# Altium project LED circuit.PrjPcb
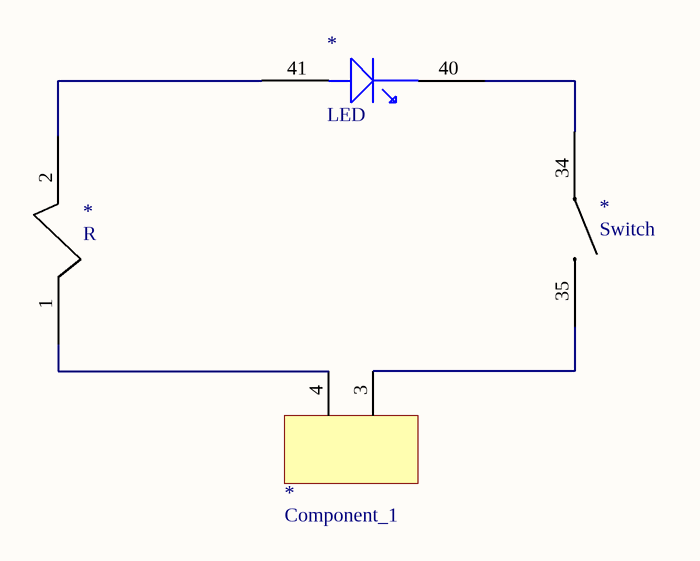
[diagram p0: Sheet1.SchDoc]
1 sheet, 4 parts. Net scope: global (net labels, ports and power ports of the same name join across sheets).
Board file: PCB1.PcbDoc

## Sheet Sheet1.SchDoc
size A; SheetNumber: 1; SheetTotal: 1

### Parts
Connector  Component_1  [Connector]
LED  LED  [LED]
R  R  [Resistor0603]
Switch  Switch  [Swicth]

### Nets
NetConnector_3: Connector.3 Switch.35
NetConnector_4: Connector.4 R.1
NetLED_40: LED.40 Switch.34
NetLED_41: LED.41 R.2